# Altium schematic sheet uC.SchDoc: uC
size A3; SheetNumber: 4
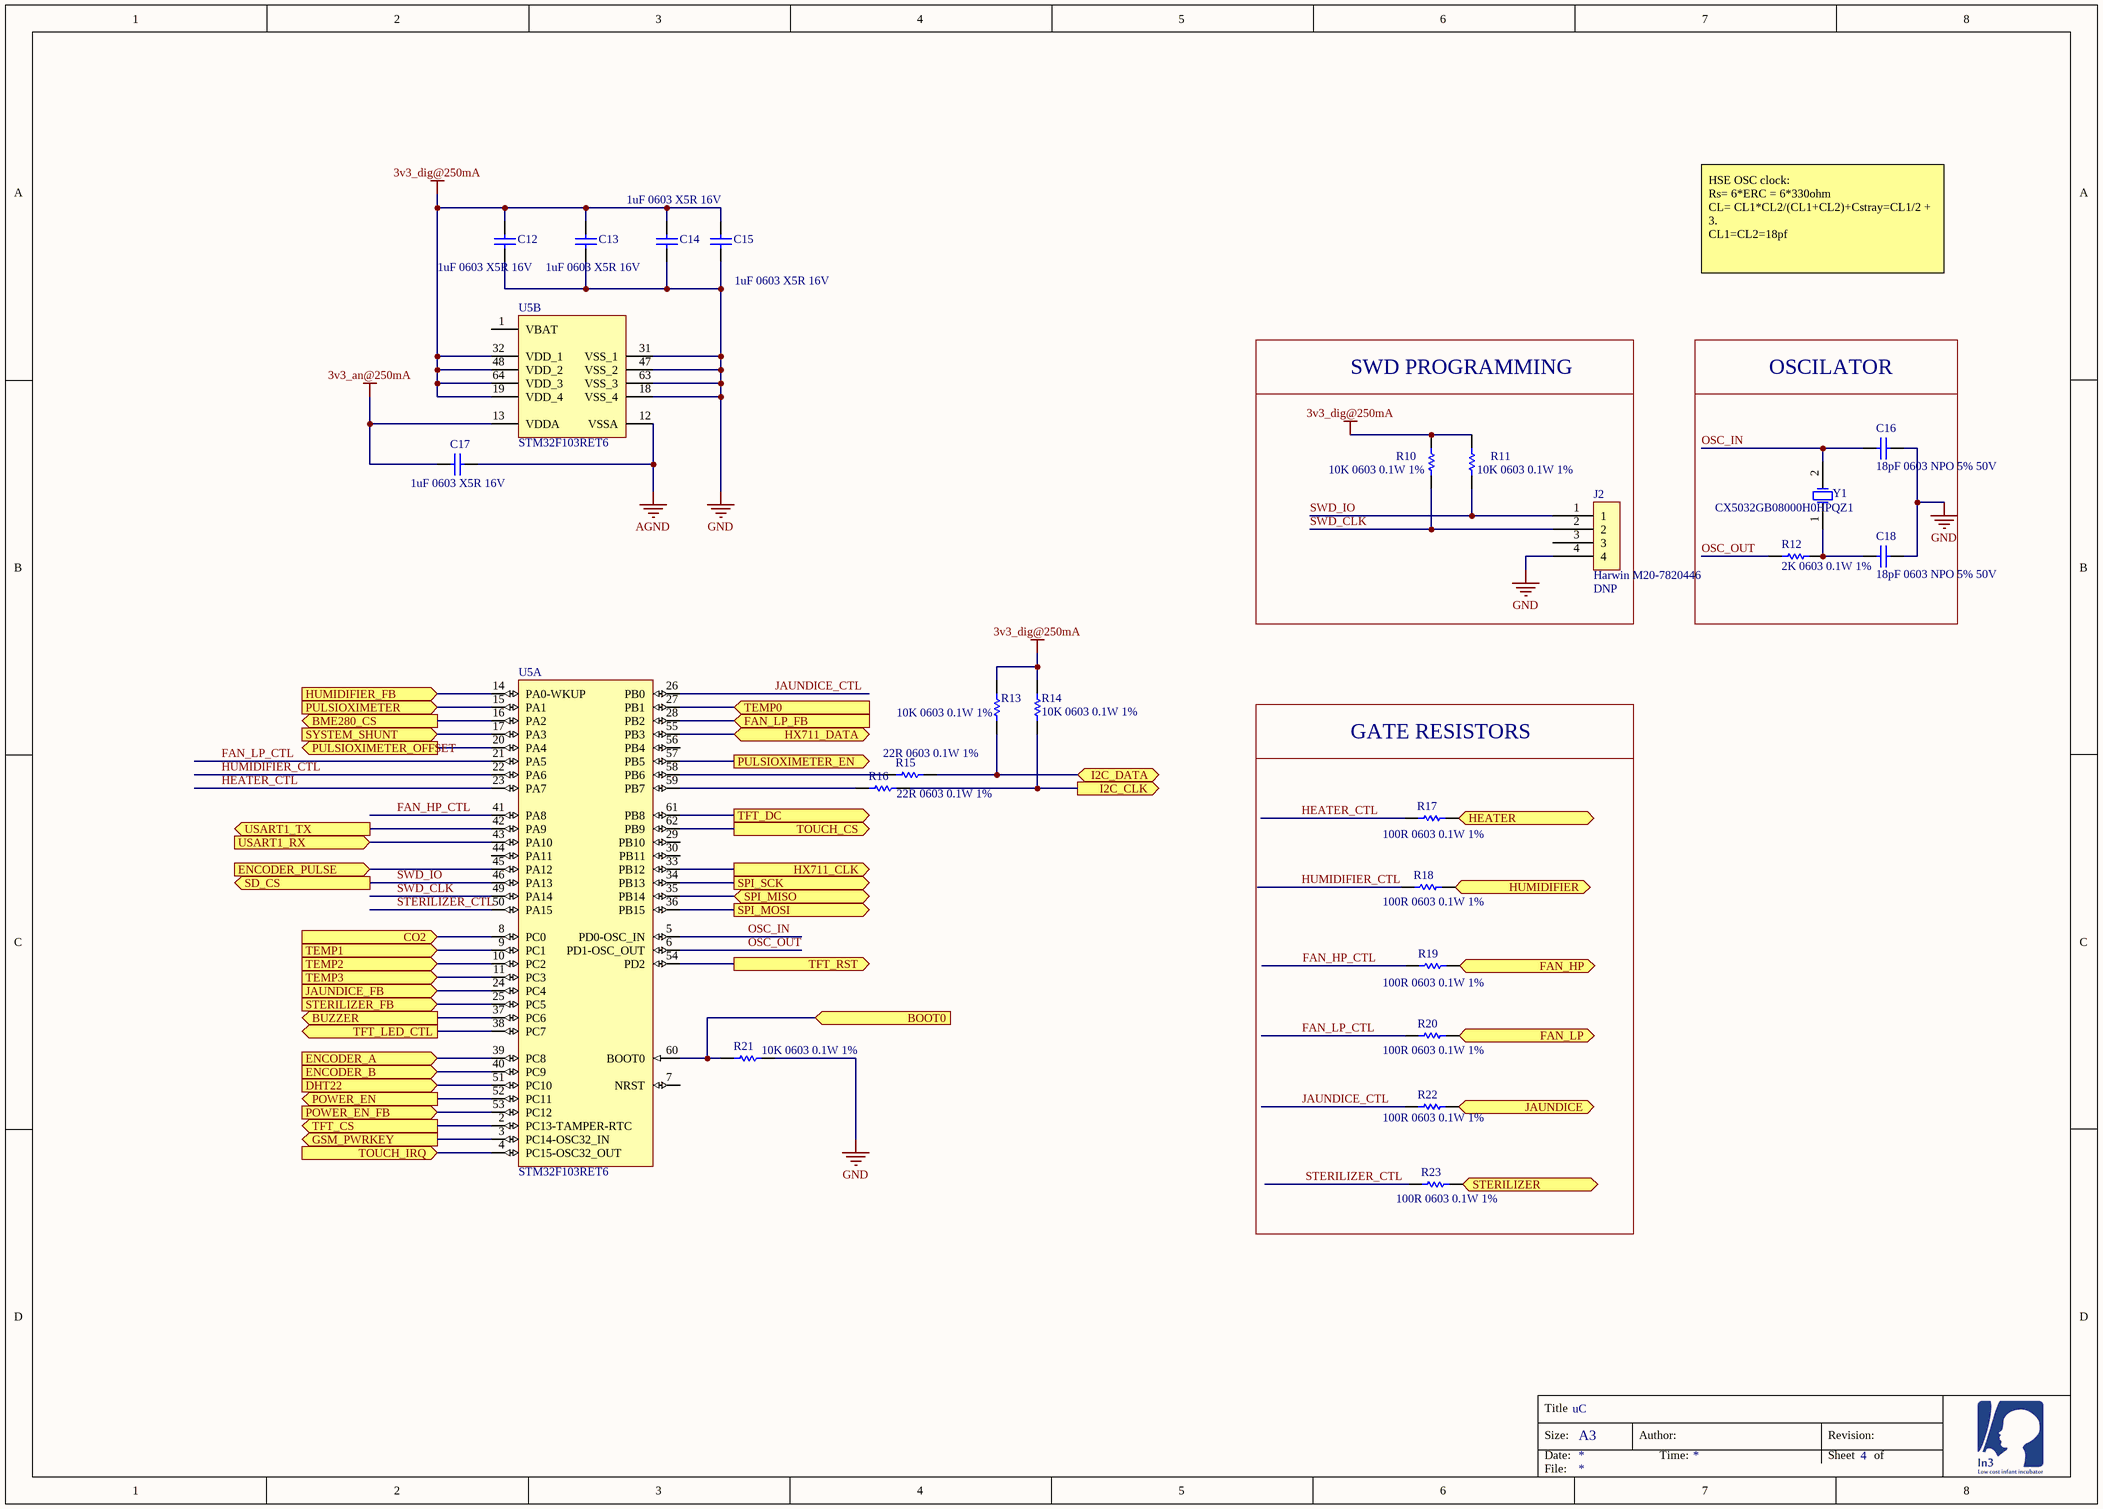
[diagram p0: uC.SchDoc]

## Parts
(Parts that share a designator on the sheet are numbered #1, #2 ... from top to bottom, then left to right.)
C12  1uF 0603 X5R 16V  [CAPC1608X60X35NL10T15]
C13  1uF 0603 X5R 16V  [CAPC1608X60X35NL10T15]
C14  1uF 0603 X5R 16V  [CAPC1608X60X35NL10T15]
C15  1uF 0603 X5R 16V  [CAPC1608X60X35NL10T15]
C16  18pF 0603 NPO 5% 50V  [CAPC1608X60X35NL10T15]
C17  1uF 0603 X5R 16V  [CAPC1608X60X35ML10T15]
C18  18pF 0603 NPO 5% 50V  [CAPC1608X60X35NL10T15]
J2  Harwin M20-7820446  [PCB-tt6oa92k1i3euqam155k-1]  (no BOM)
R10  10K 0603 0.1W 1%  [RESC1609X55X30ML10T20]
R11  10K 0603 0.1W 1%  [RESC1609X55X30ML10T20]
R12  2K 0603 0.1W 1%  [RESC1609X55X30ML10T20]
R13  10K 0603 0.1W 1%  [RESC1609X55X30ML10T20]
R14  10K 0603 0.1W 1%  [RESC1609X55X30ML10T20]
R15  22R 0603 0.1W 1%  [RESC1609X55X30ML10T20]
R16  22R 0603 0.1W 1%  [RESC1609X55X30ML10T20]
R17  100R 0603 0.1W 1%  [RESC1609X55X30ML10T20]
R18  100R 0603 0.1W 1%  [RESC1609X55X30ML10T20]
R19  100R 0603 0.1W 1%  [RESC1609X55X30ML10T20]
R20  100R 0603 0.1W 1%  [RESC1609X55X30ML10T20]
R21  10K 0603 0.1W 1%  [RESC1609X55X30ML10T20]
R22  100R 0603 0.1W 1%  [RESC1609X55X30ML10T20]
R23  100R 0603 0.1W 1%  [RESC1609X55X30ML10T20]
U5#1  STM32F103RET6  [STM-LQFP64_L]  (part B of 2)
U5#2  STM32F103RET6  [STM-LQFP64_L]  (part A of 2)
Y1  CX5032GB08000H0HPQZ1  [PCB-mm1uo60gbc5oxcl0fq61-1]

## Blocks framed on the sheet
SWD PROGRAMMING: J2 R10 R11
OSCILATOR: C16 C18 R12 Y1
GATE RESISTORS: R17-R20 R22 R23

## Ports
BME280_CS (out), BOOT0 (in), BUZZER (out), CO2 (in), DHT22 (in), ENCODER_A (in), ENCODER_B (in), ENCODER_PULSE (in), FAN_HP (out), FAN_LP (out), FAN_LP_FB (in), GSM_PWRKEY (out), HEATER (out), HUMIDIFIER (out), HUMIDIFIER_FB (in), HX711_CLK (out), HX711_DATA (bidir), I2C_CLK (out), I2C_DATA (bidir), JAUNDICE (out), JAUNDICE_FB (in), POWER_EN (out), POWER_EN_FB (in), PULSIOXIMETER (in), PULSIOXIMETER_EN (out), PULSIOXIMETER_OFFSET (out), SD_CS (out), SPI_MISO, SPI_MOSI (out), SPI_SCK (out), STERILIZER (out), STERILIZER_FB (in), SYSTEM_SHUNT (in), TEMP0 (in), TEMP1 (in), TEMP2 (in), TEMP3 (in), TFT_CS (out), TFT_DC (out), TFT_LED_CTL (out), TFT_RST (out), TOUCH_CS (out), TOUCH_IRQ (in), USART1_RX (in), USART1_TX (out)

## Nets
3v3_an@250mA: C17.1 U5#1.13(VDDA)
3v3_dig@250mA: C12.1 C13.1 C14.1 C15.1 R10.1 R11.1 R13.1 R14.1 U5#1.19(VDD_4) U5#1.32(VDD_1) U5#1.48(VDD_2) U5#1.64(VDD_3)
AGND: C17.2 U5#1.12(VSSA)
GND: C12.2 C13.2 C14.2 C15.2 C16.2 C18.2 J2.4 R21.2 U5#1.18(VSS_4) U5#1.31(VSS_1) U5#1.47(VSS_2) U5#1.63(VSS_3)
BME280_CS: U5#2.16(PA2) ; port BME280_CS
BOOT0: R21.1 U5#2.60(BOOT0) ; port BOOT0
BUZZER: U5#2.37(PC6) ; port BUZZER
CO2: U5#2.8(PC0) ; port CO2
DHT22: U5#2.51(PC10) ; port DHT22
ENCODER_A: U5#2.39(PC8) ; port ENCODER_A
ENCODER_B: U5#2.40(PC9) ; port ENCODER_B
ENCODER_PULSE: U5#2.45(PA12) ; port ENCODER_PULSE
FAN_HP: R19.1 ; port FAN_HP
FAN_HP_CTL: R19.2 U5#2.41(PA8)
FAN_LP: R20.1 ; port FAN_LP
FAN_LP_CTL: R20.2 U5#2.21(PA5)
FAN_LP_FB: U5#2.28(PB2) ; port FAN_LP_FB
GSM_PWRKEY: U5#2.3(PC14-OSC32_IN) ; port GSM_PWRKEY
HEATER: R17.1 ; port HEATER
HEATER_CTL: R17.2 U5#2.23(PA7)
HUMIDIFIER: R18.1 ; port HUMIDIFIER
HUMIDIFIER_CTL: R18.2 U5#2.22(PA6)
HUMIDIFIER_FB: U5#2.14(PA0-WKUP) ; port HUMIDIFIER_FB
HX711_CLK: U5#2.33(PB12) ; port HX711_CLK
HX711_DATA: U5#2.55(PB3) ; port HX711_DATA
I2C_CLK: R14.2 R16.2 ; port I2C_CLK
I2C_DATA: R13.2 R15.2 ; port I2C_DATA
JAUNDICE: R22.1 ; port JAUNDICE
JAUNDICE_CTL: R22.2 U5#2.26(PB0)
JAUNDICE_FB: U5#2.24(PC4) ; port JAUNDICE_FB
OSC_IN: C16.1 U5#2.5(PD0-OSC_IN) Y1.2(OSC2)
OSC_OUT: R12.2 U5#2.6(PD1-OSC_OUT)
POWER_EN: U5#2.52(PC11) ; port POWER_EN
POWER_EN_FB: U5#2.53(PC12) ; port POWER_EN_FB
PULSIOXIMETER: U5#2.15(PA1) ; port PULSIOXIMETER
PULSIOXIMETER_EN: U5#2.57(PB5) ; port PULSIOXIMETER_EN
PULSIOXIMETER_OFFSET: U5#2.20(PA4) ; port PULSIOXIMETER_OFFSET
SPI_MISO: U5#2.35(PB14) ; port SPI_MISO
SPI_MOSI: U5#2.36(PB15) ; port SPI_MOSI
SPI_SCK: U5#2.34(PB13) ; port SPI_SCK
STERILIZER: R23.1 ; port STERILIZER
STERILIZER_CTL: R23.2 U5#2.50(PA15)
STERILIZER_FB: U5#2.25(PC5) ; port STERILIZER_FB
SWD_CLK: J2.2 R10.2 U5#2.49(PA14)
SWD_IO: J2.1 R11.2 U5#2.46(PA13) ; port SD_CS
SYSTEM_SHUNT: U5#2.17(PA3) ; port SYSTEM_SHUNT
TEMP0: U5#2.27(PB1) ; port TEMP0
TEMP1: U5#2.9(PC1) ; port TEMP1
TEMP2: U5#2.10(PC2) ; port TEMP2
TEMP3: U5#2.11(PC3) ; port TEMP3
TFT_CS: U5#2.2(PC13-TAMPER-RTC) ; port TFT_CS
TFT_DC: U5#2.61(PB8) ; port TFT_DC
TFT_LED_CTL: U5#2.38(PC7) ; port TFT_LED_CTL
TFT_RST: U5#2.54(PD2) ; port TFT_RST
TOUCH_CS: U5#2.62(PB9) ; port TOUCH_CS
TOUCH_IRQ: U5#2.4(PC15-OSC32_OUT) ; port TOUCH_IRQ
USART1_RX: U5#2.43(PA10) ; port USART1_RX
USART1_TX: U5#2.42(PA9) ; port USART1_TX
NetC18_1: C18.1 R12.1 Y1.1(OSC1)
NetR15_1: R15.1 U5#2.58(PB6)
NetR16_1: R16.1 U5#2.59(PB7)

Not connected (* = marked no-connect by the designer): J2 3; U5#1 1(VBAT); U5#2 7(NRST) 29(PB10) 30(PB11) 44(PA11) 56(PB4)

## Notes on the sheet
- HSE OSC clock:
  Rs= 6*ERC = 6*330ohm
  CL= CL1*CL2/(CL1+CL2)+Cstray=CL1/2 + 3.
  CL1=CL2=18pf
- Title
- Size:
- Date:
- A3
- Author:
- Time:
- Revision:
- Sheet
- of
- File:

## Library data of the parts
C12-C15 C17 = CMP-119984-2: Manufacturer Part Number: GRM185R61C105KE44D; Capacitance Tolerance: ±10%; Case/Package (in): 0603; Lead-Free Status: Lead Free; Capacitance: 1uF; Dielectric Characteristic: X5R; Lifecycle Status: Active; Mounting Style: Surface Mount; Number of Pins: 2; Octopart Url: https://octopart.com/grm185r61c105ke44d-murata-197446; OctopartID: de3e1737f81e01f9; REACH SVHC Compliance: No SVHC; RoHS: Compliant; Size-Height: 0.0005 m; Size-Length: 0.0016 m; Size-Thickness: 0.0005 m; Size-Width: 0.0008 m; Rated voltage: 16V
C16 C18 = CMP-35cbf9f8b0acea0c-1: Manufacturer Part Number: C0603C180K5RACTU; Capacitance: 18.0 pF; Capacitance Tolerance: ±10%; Dielectric Characteristic: X7R; Dielectric Material: Ceramic; Lead-Free Status: R; Voltage Rating (DC): 50.0 V; Octopart URL: https://octopart.com/c0603c180k5racauto-kemet-87662593; Case/Package: 0603; Mounting Style: Surface Mount; Operating Temperature: -55.0 °C (min); RoHS: Compliant; OctopartID: 35cbf9f8b0acea0c
J2 = CMP-2481958-5: Conn Socket Strip SKT 4 POS 2.54mm Solder ST Thru-Hole Tube; Number of Contacts: 4; Current Rating: 3.00 A; Insulation Resistance: 1.00 MΩ; Number of Mating Cycles: 50; Gender: Female; Contact Resistance: 15.0 mΩ; Contact Material: Phosphor Bronze; Number of Rows: 1; OctopartID: 0d9ac4c1d3c6d25d; Pin Pitch: 2.54 mm; Octopart URL: http://octopart.com/m20-7820446-harwin-5372730; RoHS: Compliant; REACH SVHC Compliance: No SVHC; Contact Plating: Tin; Mounting Style: Through Hole, Vertical; Manufacturer Part Number: M20-7820446; DNP: DNP
R10 R11 R13 R14 R21 = CMP-4716590-9: Octopart Url: https://octopart.com/crcw060310k0fkeahp-vishay-42634028; package: 0603; Resistance: 10k; Tolerance: 1%
R12 = CMP-3655986-6: Resistance: 2K; Tolerance: 1%; package: 0603
R15 R16 = CMP-1846194-8: Tolerance: 1%; Value: 22R; package: 0603
R17-R20 R22 R23 = CMP-a61f6f36030f79d8-4: Manufacturer Part Number: CR0603-FX-1001ELF; Power Rating: 100 mW; Resistance: 1k; Case/Package (SI): 1608; Voltage Rating (DC): 50.0 V; Temperature Coefficient: -100 ppm/°C to 100 ppm/°C; REACH SVHC Compliance: No SVHC; Packaging: Tape & Reel (TR), Cut Tape (CT); Resistance Tolerance: ±1%; RoHS: Compliant; Mounting Style: Surface Mount; Number of Pins: 2; Size-Length: 1.60 mm; Octopart URL: https://octopart.com/cr0603-fx-1001elf-bourns-2326646; Size-Thickness: 457 µm; OctopartID: a61f6f36030f79d8; Size-Width: 787 µm; Case/Package: 0603
U5#1 U5#2 = CMP-2386707-4: ARM Cortex-M3 32-bit MCU, 512 KB Flash, 64 KB Internal RAM, 51 I/Os, 64-pin LQFP, -40 to 85 degC, Tray; Clock Speed: 72000000.0 Hz; FLASH Memory Size: 524288 B; Lead-Free Status: Lead Free; Number of Bits: 32; RAM Memory Size: 65536 B; Lifecycle Status: Active; Mounting Style: Surface Mount; Number of Pins: 64; Octopart Url: https://octopart.com/stm32f103ret6-stmicroelectronics-8119628; OctopartID: bab873c97a92657f; REACH SVHC Compliance: No SVHC; RoHS: Compliant
Y1 = CMP-4fdd8615a0ef901a-1: Crystal 8Mhz 30ppm -40ºC/+85ºC 12pF 300ohm; Manufacturer Part Number: CX5032GB08000H0HPQZ1; Packaging: Reel; Mounting Style: Surface Mount